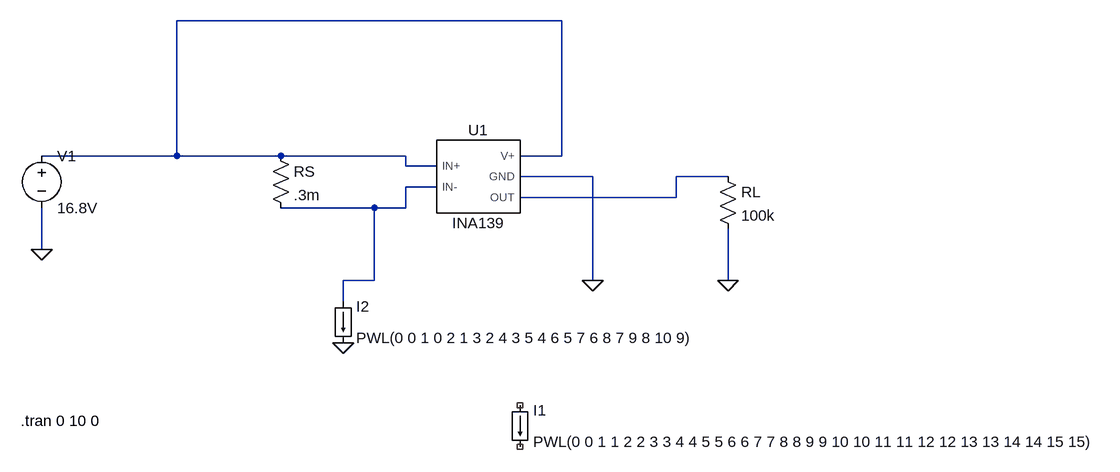
[diagram p0: schematic Draft1.asc]
Draft1.asc, the LTspice schematic file:
Version 4
SHEET 1 2744 680
WIRE 336 -80 -256 -80
WIRE -256 128 -256 -80
WIRE -256 128 -464 128
WIRE -96 128 -256 128
WIRE 96 128 -96 128
WIRE 336 128 336 -80
WIRE 336 128 272 128
WIRE 96 144 96 128
WIRE 144 144 96 144
WIRE 384 160 272 160
WIRE 592 160 512 160
WIRE 144 176 96 176
WIRE 512 192 512 160
WIRE 512 192 272 192
WIRE 48 208 -96 208
WIRE 96 208 96 176
WIRE 96 208 48 208
WIRE -464 272 -464 208
WIRE 48 320 48 208
WIRE 48 320 0 320
WIRE 384 320 384 160
WIRE 592 320 592 240
WIRE 0 352 0 320
FLAG 384 320 0
FLAG 592 320 0
FLAG -464 272 0
FLAG 0 416 0
SYMBOL INA139 208 160 R0
SYMATTR InstName U1
SYMBOL res 576 144 R0
SYMATTR InstName RL
SYMATTR Value 100k
SYMATTR SpiceLine tol=1
SYMBOL res -112 112 R0
SYMATTR InstName RS
SYMATTR Value .3m
SYMBOL voltage -464 112 R0
WINDOW 123 0 0 Left 0
WINDOW 39 0 0 Left 0
SYMATTR InstName V1
SYMATTR Value 16.8V
SYMBOL load 256 512 R0
SYMATTR InstName I1
SYMATTR Value PWL(0 0 1 1 2 2 3 3 4 4 5 5 6 6 7 7 8 8 9 9 10 10 11 11 12 12 13 13 14 14 15 15)
SYMBOL load -16 352 R0
WINDOW 123 0 0 Left 0
WINDOW 39 0 0 Left 0
SYMATTR InstName I2
SYMATTR Value PWL(0 0 1 0 2 1 3 2 4 3 5 4 6 5 7 6 8 7 9 8 10 9)
TEXT -496 536 Left 2 !.tran 0 10 0

The netlist it stands for:
* Draft1.asc
XU1 N001 N003 N001 0 N002 INA139  ; pins IN+ IN- V+ GND OUT
RL N002 0 100k tol=1
RS N001 N003 .3m
V1 N001 0 16.8V
I1 NC_01 NC_02 PWL(0 0 1 1 2 2 3 3 4 4 5 5 6 6 7 7 8 8 9 9 10 10 11 11 12 12 13 13 14 14 15 15)
I2 N003 0 PWL(0 0 1 0 2 1 3 2 4 3 5 4 6 5 7 6 8 7 9 8 10 9)
.tran 0 10 0
.lib C:\Users\tomix\Documents\GitHub\SeniorDesign-Team9\Simulations\INA169 - LTSpice\symbol\ina139.lib
.backanno
.end